# EAGLE design cooling_system_at8pu (EAGLE 8.4.0)
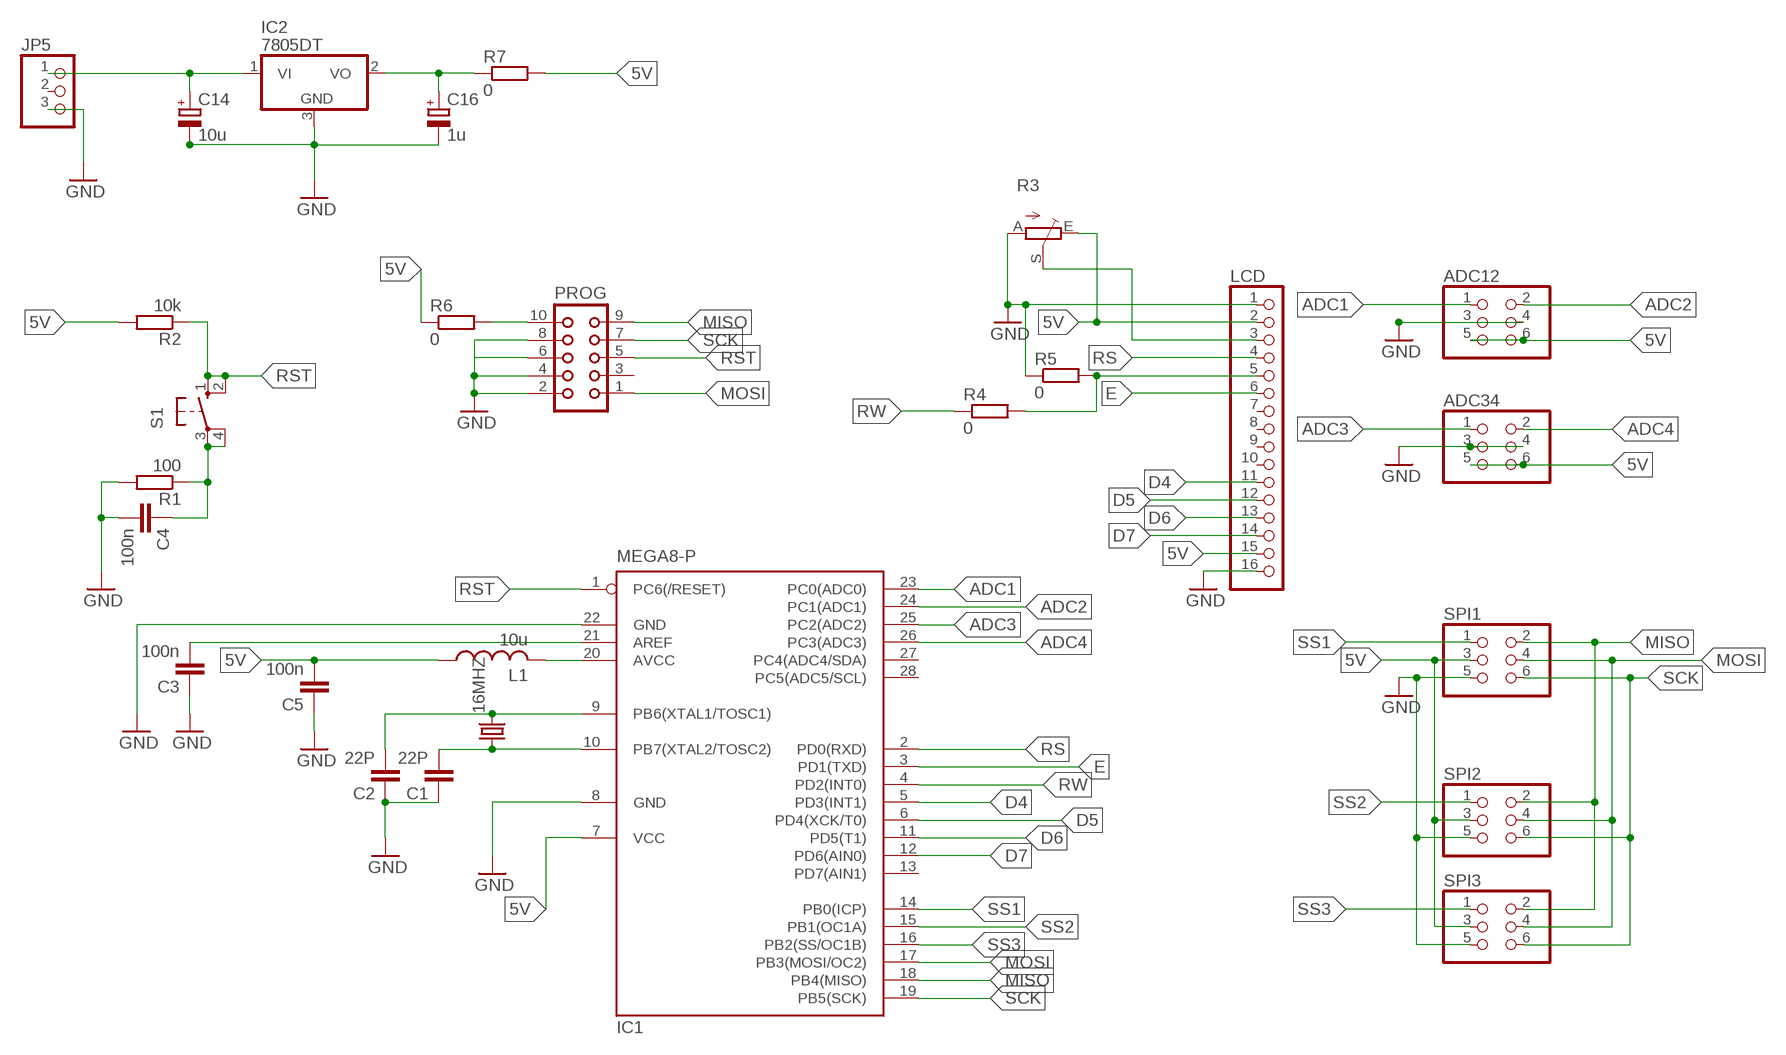
[diagram p0: schematic, sheet 1]

## Parts
16MHZ  CRYSTALHC18U-V  [HC18U-V]
ADC12  PINHD-2X3  [2X03]
ADC34  PINHD-2X3  [2X03]
C1  22P  C-EUC0805  [C0805]
C2  22P  C-EUC0805  [C0805]
C3  100n  C-EUC0805  [C0805]
C4  100n  C-EUC0805  [C0805]
C5  100n  C-EUC0805  [C0805]
C14  10u  CPOL-EU153CLV-0605  [153CLV-0605]
C16  1u  CPOL-EU153CLV-0405  [153CLV-0405]
IC1  MEGA8-P  [DIL28-3]
IC2  7805DT  [TO252]
JP5  PINHD-1X3  [1X03]
L1  10u  L-US0204/7  [0204/7]
LCD  PINHD-1X16  [1X16]
PROG  CON10  [CON10]
R1  100  R-EU_0207/10  [0207/10]
R2  10k  R-EU_0207/10  [0207/10]
R3  TRIM_EU-CT6  [CT6]
R4  0  R-EU_R0805  [R0805]
R5  0  R-EU_R0805  [R0805]
R6  0  R-EU_R0805  [R0805]
R7  0  R-EU_R0805  [R0805]
S1  10-XX  [B3F-10XX]
SPI1  PINHD-2X3  [2X03]
SPI2  PINHD-2X3  [2X03]
SPI3  PINHD-2X3  [2X03]

## Nets
5V: ADC12.5 ADC12.6 ADC34.5 ADC34.6 C5.2 IC1.7(VCC) L1.1 LCD.2 LCD.15 R2.2 R3.E R6.1 R7.2 SPI1.3 SPI2.3 SPI3.3
ADC1: ADC12.1 IC1.23(PC0(ADC0))
ADC2: ADC12.2 IC1.24(PC1(ADC1))
ADC3: ADC34.1 IC1.25(PC2(ADC2))
ADC4: ADC34.2 IC1.26(PC3(ADC3))
D4: IC1.5(PD3(INT1)) LCD.11
D5: IC1.6(PD4(XCK/T0)) LCD.12
D6: IC1.11(PD5(T1)) LCD.13
D7: IC1.12(PD6(AIN0)) LCD.14
E: IC1.3(PD1(TXD)) LCD.6
GND: ADC12.3 ADC12.4 ADC34.3 ADC34.4 C1.1 C2.1 C3.1 C4.2 C5.1 C14.- C16.- IC1.8(GND) IC1.22(GND) IC2.3(GND) JP5.3 LCD.1 LCD.16 PROG.2 PROG.4 PROG.6 PROG.8 R1.2 R3.A R5.1 SPI1.5 SPI2.5 SPI3.5
MISO: IC1.18(PB4(MISO)) PROG.9 SPI1.2 SPI2.2 SPI3.2
MOSI: IC1.17(PB3(MOSI/OC2)) PROG.1 SPI1.4 SPI2.4 SPI3.4
N$1: 16MHZ.2 C2.2 IC1.9(PB6(XTAL1/TOSC1))
N$2: 16MHZ.1 C1.2 IC1.10(PB7(XTAL2/TOSC2))
N$3: IC1.20(AVCC) L1.2
N$4: C3.2 IC1.21(AREF)
N$6: C4.1 R1.1 S1.3(P) S1.4(P1)
N$7: LCD.5 R4.2 R5.2
N$9: LCD.3 R3.S
N$12: PROG.10 R6.2
N$22: C16.+ IC2.2(VO) R7.1
N$24: C14.+ IC2.1(VI) JP5.1
RS: IC1.2(PD0(RXD)) LCD.4
RST: IC1.1(PC6(/RESET)) PROG.5 R2.1 S1.1(S) S1.2(S1)
RW: IC1.4(PD2(INT0)) R4.1
SCK: IC1.19(PB5(SCK)) PROG.7 SPI1.6 SPI2.6 SPI3.6
SS1: IC1.14(PB0(ICP)) SPI1.1
SS2: IC1.15(PB1(OC1A)) SPI2.1
SS3: IC1.16(PB2(SS/OC1B)) SPI3.1
Unconnected: IC1.13(PD7(AIN1)) IC1.27(PC4(ADC4/SDA)) IC1.28(PC5(ADC5/SCL)) JP5.2 LCD.7 LCD.8 LCD.9 LCD.10 PROG.3

## Library data of the parts
16MHZ = crystal:CRYSTAL: CRYSTAL; OC_FARNELL: unknown; OC_NEWARK: unknown
ADC12 ADC34 SPI1-SPI3 = pinhead:PINHD-2X3: PIN HEADER
C1-C5 = resistor:C-EU: CAPACITOR, European symbol
C14 C16 = resistor:CPOL-EU: POLARIZED CAPACITOR, European symbol
IC1 = atmel:MEGA8-P: MICROCONTROLLER 8 Kbytes FLASH, 1 kbytes SRAM, 512 bytes EEPROM, USART, 4-channel 10 bit ADC, 2-channel 8 bit ADC Pin compatible with Atmega48, ATMega88, ATMega168 Source: avr.lbr; OC_FARNELL: unknown; OC_NEWARK: unknown
IC2 = linear:78*: Positive VOLTAGE REGULATOR Source: http://cache.national.com/ds/LM/LM78L05.pdf http://www.fairchildsemi.com/ds/LM/LM7805.pdf
JP5 = pinhead:PINHD-1X3: PIN HEADER
L1 = resistor:L-US: INDUCTOR, American symbol
LCD = pinhead:PINHD-1X16: PIN HEADER
PROG = con-harting:CON10: CONNECTOR; OC_FARNELL: unknown; OC_NEWARK: unknown
R1 R2 R4-R7 = resistor:R-EU_: RESISTOR, European symbol
R3 = pot:TRIM_EU-: POTENTIOMETER
S1 = switch-omron:10-XX: OMRON SWITCH; MPN: B3F-1000; OC_FARNELL: 176432; OC_NEWARK: 36M3542

## Board
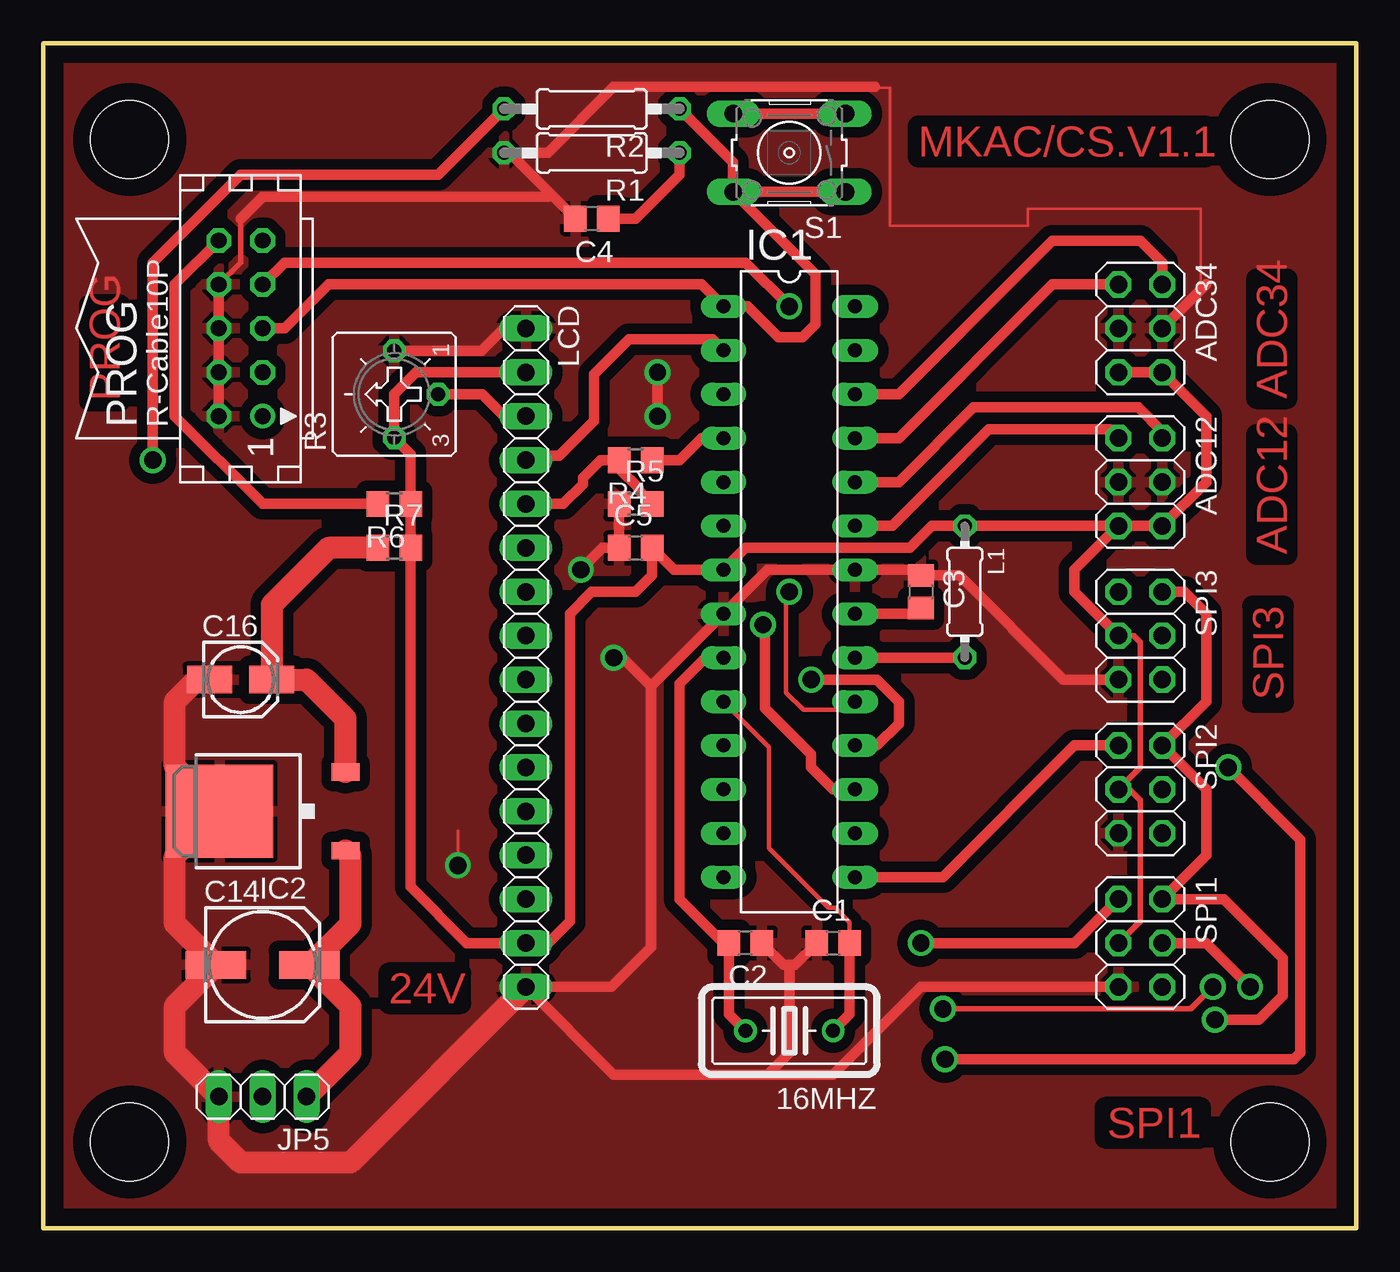
[diagram p1: board, top side]
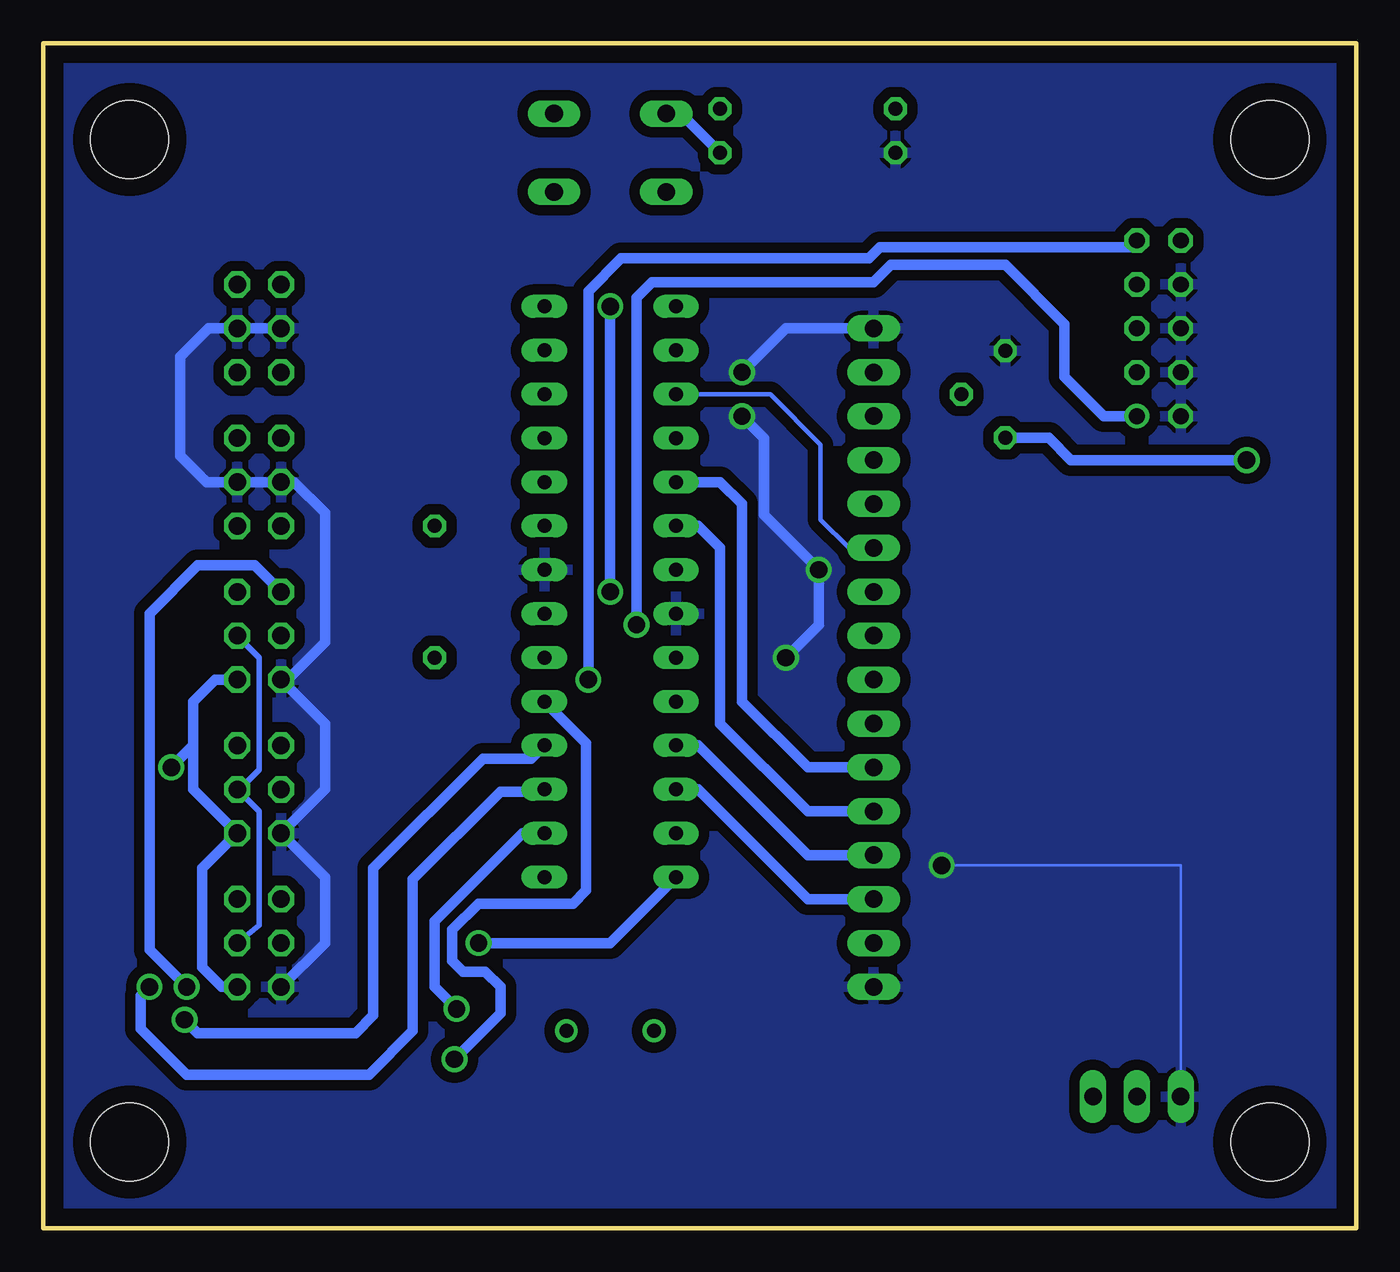
[diagram p2: board, bottom side, seen from below]

Size 76 x 68.57 mm. Coordinates in mm from the lower left corner, seen from the top.
Outline: 0,0 76,0 76,68.57 0,68.57 0,0
Copper layers (1*16): Top 0.035mm / dielectric 1.5mm / Bottom 0.035mm
Design rules "default": minimum track width 6mil, minimum drill 0.35mm, track to track 6mil, track to pad 6mil, pad to pad 6mil, via to via 6mil, smd to smd 6mil, copper to edge 40mil, drill to drill 6mil, minimum pad ring 10mil, minimum via ring 8mil, stop-mask expansion 4mil, vias tented up to drill 0mil, thermal gap 10mil
Holes 4.5 mm at 71,5 5,63 71,63 5,5

### Footprints (pad centres in the part's own frame; a part is rotated, then mirrored left to right if it is on the bottom)
HC18U-V = drill 0.813: 1 -2.54,0; 2 2.54,0
2X03 = drill 1.016 octagon: 1 -2.54,-1.27; 2 -2.54,1.27; 3 0,-1.27; 4 0,1.27; 5 2.54,-1.27; 6 2.54,1.27
C0805 = smd 1.3 x 1.5: 1 -0.95,0; 2 0.95,0
153CLV-0605 = smd 3.5 x 1.6: + 2.7,0; - -2.7,0
153CLV-0405 = smd 2.6 x 1.6: + 1.8,0; - -1.8,0
DIL28-3 = drill 0.813 long: 1 -16.51,-3.81; 2 -13.97,-3.81; 3 -11.43,-3.81; 4 -8.89,-3.81; 5 -6.35,-3.81; 6 -3.81,-3.81; 7 -1.27,-3.81; 8 1.27,-3.81; 9 3.81,-3.81; 10 6.35,-3.81; 11 8.89,-3.81; 12 11.43,-3.81; 13 13.97,-3.81; 14 16.51,-3.81; 15 16.51,3.81; 16 13.97,3.81; 17 11.43,3.81; 18 8.89,3.81; 19 6.35,3.81; 20 3.81,3.81; 21 1.27,3.81; 22 -1.27,3.81; 23 -3.81,3.81; 24 -6.35,3.81; 25 -8.89,3.81; 26 -11.43,3.81; 27 -13.97,3.81; 28 -16.51,3.81
TO252 = smd 1 x 1.6: 1 -2.28,-4.8; 2 2.28,-4.8 | smd 5.4 x 6.2: 3 0,2.5
1X03 = drill 1.016 long: 1 -2.54,0; 2 0,0; 3 2.54,0
0204/7 = drill 0.813 octagon: 1 -3.81,0; 2 3.81,0
1X16 = drill 1.016 long: 1 -19.05,0; 2 -16.51,0; 3 -13.97,0; 4 -11.43,0; 5 -8.89,0; 6 -6.35,0; 7 -3.81,0; 8 -1.27,0; 9 1.27,0; 10 3.81,0; 11 6.35,0; 12 8.89,0; 13 11.43,0; 14 13.97,0; 15 16.51,0; 16 19.05,0
CON10 = drill 0.914: 1 -5.08,-1.27 | drill 0.914 octagon: 2 -5.08,1.27; 3 -2.54,-1.27; 4 -2.54,1.27; 5 0,-1.27; 6 0,1.27; 7 2.54,-1.27; 8 2.54,1.27; 9 5.08,-1.27; 10 5.08,1.27
0207/10 = drill 0.813 octagon: 1 -5.08,0; 2 5.08,0
CT6 = drill 0.813 octagon: A 2.515,0; E -2.515,0; S 0,-2.54
R0805 = smd 1.3 x 1.5: 1 -0.95,0; 2 0.95,0
B3F-10XX = drill 1.016 long: 1 -3.251,2.261; 2 3.251,2.261; 3 -3.251,-2.261; 4 3.251,-2.261

### Placement (x,y rotation side)
16MHZ  43.18,11.43 180 top
ADC12  63.5,43.18 270 top
ADC34  63.5,52.07 270 top
C1  45.72,16.51 0 top
C2  40.64,16.51 180 top
C3  50.8,36.83 270 top
C4  31.75,58.42 180 top
C5  34.29,39.37 0 top
C14  12.7,15.24 0 top
C16  11.43,31.75 0 top
IC1  43.18,36.83 270 top
IC2  12.7,24.13 90 top
JP5  12.7,7.62 180 top
L1  53.34,36.83 270 top
LCD  27.94,33.02 270 top
PROG  11.43,52.07 90 top
R1  31.75,62.23 180 top
R2  31.75,64.77 180 top
R3  20.32,48.26 90 top
R4  34.29,44.45 180 top
R5  34.29,41.91 0 top
R6  20.32,41.91 180 top
R7  20.32,39.37 0 top
S1  43.18,62.23 180 top
SPI1  63.5,16.51 270 top
SPI2  63.5,25.4 270 top
SPI3  63.5,34.29 270 top

### Tracks (layer width: path | path; a pad name or v marks a point on that pad's centre or on a via)
5V  (via drill 1)
  Top 0.305: SPI1.3 63.5,17.78 63.5,24.77 62.87,25.4 SPI2.3 63.5,26.67 63.5,33.91 63.12,34.29 SPI3.3
  Top 0.61: ADC12.5 L1.1 51.44,40.64 50.16,39.37 40.64,39.37 IC1.7 36.51,38.1 C5.2 35.24,37.78 34.29,36.83 31.75,36.83 30.48,35.56 30.48,17.78 29.21,16.51 LCD.15 24.51,16.51 21.27,19.75 R7.2 R6.1 21.27,44.8 R3.E 20.32,48.26 21.59,49.53 LCD.2 | ADC12.5 ADC12.6 67.31,43.18 67.31,46.99 ADC34.6 ADC34.5 | ADC12.5 59.69,38.1 59.69,36.83 SPI3.3 | R2.2 22.86,60.96 11.43,60.96 6.35,55.88 v6.35,44.45
  Bottom 0.61: v6.35,44.45 16.51,44.45 17.8,45.74 R3.E
ADC1
  Top 0.61: ADC12.1 61.72,46.23 54.74,46.23 49.15,40.64 IC1.23
ADC2
  Top 0.61: IC1.24 49.53,43.18 53.85,47.5 63.37,47.5 64.77,46.1 ADC12.2
ADC3
  Top 0.61: ADC34.1 58.42,54.61 49.53,45.72 IC1.25
ADC4
  Top 0.61: IC1.26 49.53,48.26 58.42,57.15 63.5,57.15 64.77,55.88 ADC34.2
D4
  Bottom 0.61: IC1.5 36.83,43.18 35.56,41.91 35.56,30.48 31.75,26.67 LCD.11
D5
  Bottom 0.61: LCD.12 31.75,24.13 36.83,29.21 36.83,39.37 38.1,40.64 IC1.6
D6
  Bottom 0.61: IC1.11 38.1,27.94 31.75,21.59 LCD.13
D7
  Bottom 0.61: IC1.12 38.1,25.4 31.75,19.05 LCD.14
E
  Bottom 0.254: IC1.3 33.91,48.26 31,45.35 31,41 29.37,39.37 LCD.6
GND  (via drill 1)
  Top 0.152: v24,21 24,23 | 48.15,66.04 48.15,66 49,66 49,58 57,58 57,59 67,59 67,54.15 66.85,54.15
  Top 0.305: PROG.8 11.43,55.88 11.43,58.42
  Top 0.61: SPI3.5 59.05,31.75 53.02,37.78 C3.1 50.48,38.1 IC1.22 41.91,38.1 IC1.8 35.18,31.37 | 41.91,8.89 33.02,8.89 LCD.16 32.89,13.97 35.18,16.26 35.18,31.37 | 41.91,8.89 43.18,10.16 43.18,15.24 | C2.1 42.86,15.24 43.18,15.24 | 43.18,15.24 43.5,15.24 C1.1 | SPI1.5 50.8,13.97 45.72,8.89 41.91,8.89 | R3.A 25.38,50.77 26.67,52.07 LCD.1 | 29.37,59.85 C4.2 | 29.37,59.85 26.99,62.23 R1.2 29.21,62.23 33.02,66.04 48.15,66.04 | PROG.2 PROG.4 PROG.6 PROG.8 | 11.43,58.42 12.7,59.69 29.21,59.69 29.37,59.85 | 67.31,54.61 66.85,54.15 ADC34.4 | v31.11,38.1 32.38,39.37 C5.1 R5.1 | v33.02,33.02 33.53,33.02 35.18,31.37 | v35.56,46.99 v35.56,49.53
  Top 1.27: C16.- 8.89,31.75 7.62,30.48 7.62,26.71 IC2.3 7.62,21.55 7.62,17.62 C14.- 7.62,12.86 7.62,10.16 JP5.3 10.16,5.08 11.43,3.81 17.78,3.81 LCD.16
  Bottom 0.152: JP5.3 10.16,21 v24,21
  Bottom 0.61: SPI1.5 59.69,16.51 59.69,20.32 SPI2.5 59.69,25.4 59.69,29.21 SPI3.5 61.85,31.75 59.69,33.91 59.69,41.4 61.47,43.18 ADC12.3 ADC12.4 66.55,43.18 68.07,44.7 68.07,50.42 66.42,52.07 ADC34.4 ADC34.3 | v33.02,33.02 31.11,34.92 v31.11,38.1 34.29,41.27 34.29,45.72 v35.56,46.99 | v35.56,49.53 33.02,52.07 LCD.1
  pour Top (isolate 0.61): 1.27,1.27 1.27,68.58 74.93,68.58 74.93,1.27
  pour Bottom (isolate 0.61): 1.27,1.27 1.27,68.58 74.93,68.58 74.93,1.27
MISO  (via drill 1)
  Top 0.61: SPI3.2 66.04,36.83 67.31,35.56 67.31,30.48 SPI2.2 67.31,25.4 67.31,21.59 SPI1.2 68.33,19.05 71.75,15.62 71.75,13.46 70.36,12.06 v67.82,12.06 | v44.45,31.75 48.26,31.75 49.53,30.48 49.53,29.21 48.26,27.94 IC1.18
  Bottom 0.61: IC1.18 47.75,27.18 50.55,27.18 56.9,20.83 56.9,12.32 57.91,11.3 67.06,11.3 v67.82,12.06 | PROG.9 13.08,56.77 27.56,56.77 28.19,56.13 42.55,56.13 44.45,54.23 v44.45,31.75
MOSI  (via drill 1)
  Top 0.61: v69.85,13.97 67.31,16.51 SPI1.4 | IC1.17 45.72,25.4 44.45,26.67 44.45,27.43 41.78,30.1 41.78,34.8 v41.66,34.92
  Bottom 0.305: SPI3.4 63.5,33.02 63.5,26.54 64.64,25.4 SPI2.4 63.5,24.13 63.5,17.53 SPI1.4
  Bottom 0.61: IC1.17 47.12,25.27 49.53,25.27 54.61,20.19 54.61,11.43 57.15,8.89 67.69,8.89 70.36,11.56 70.36,13.46 v69.85,13.97 | v41.66,34.92 41.66,53.85 40.77,54.74 27.94,54.74 26.92,55.75 20.32,55.75 16.89,52.32 16.89,49.28 14.61,46.99 PROG.1
N$1
  Top 0.254: IC1.9 39.98,33.02 40,33
  Top 0.61: 16MHZ.2 39.69,12.38 C2.2 39.37,16.51 36.83,19.05 36.83,31.5 38.48,33.15 38.61,33.02 IC1.9
N$2
  Top 0.254: IC1.10 42,27.85 42,22 45.46,18.54 45.85,18.54 46.67,17.72 C1.2
  Top 0.61: C1.2 46.67,12.38 16MHZ.1
N$3
  Top 0.61: L1.2 IC1.20
N$4
  Top 0.61: IC1.21 50.48,35.56 C3.2
N$6
  Top 0.61: C4.1 34.29,58.42 36.83,60.96 R1.1 | S1.3 S1.4
  Bottom 0.61: R1.1 39.09,64.49 S1.4
N$7
  Top 0.61: LCD.5 30.1,41.91 31.24,43.05 31.24,43.43 32.26,44.45 R4.2 33.34,43.96 34.45,42.85 34.45,42.7 R5.2
N$9
  Top 0.61: LCD.3 26.67,46.99 25.4,48.26 R3.S
N$12
  Top 0.61: PROG.10 7.62,54.61 7.62,46.99 12.7,41.91 R6.2
N$22
  Top 1.27: IC2.2 17.5,29.49 15.24,31.75 C16.+ 13.23,36.09 16.51,39.37 R7.1
N$24
  Top 1.27: JP5.1 17.78,10.16 17.78,12.86 C14.+ 17.78,17.62 17.78,21.57 IC2.1
RS
  Top 0.61: LCD.4 28.19,44.7 29.84,44.7 31.88,46.74 31.88,49.4 33.91,51.44 38.73,51.44 IC1.2
RST
  Top 0.61: PROG.5 13.97,52.07 16.51,54.61 38.1,54.61 IC1.1 40.77,53.34 42.55,51.56 43.94,51.56 44.7,52.32 44.7,55.19 S1.2 | S1.2 39.93,61.67 R2.1 | S1.1 S1.2
RW
  Top 0.61: IC1.4 38.1,45.72 36.83,44.45 R4.1
SCK  (via drill 1)
  Top 0.254: v43.18,36.83 43,36.65 43,31 44,30 46,30 46.48,30.48 IC1.19
  Top 0.61: v68.58,26.67 72.77,22.48 72.77,10.16 72.39,9.78 v52.2,9.78 | IC1.19 46.93,30.54 | v43.18,53.34 40.64,55.88 13.97,55.88 PROG.7
  Bottom 0.61: SPI1.6 65.66,13.97 66.8,15.11 66.8,20.83 SPI2.6 67.31,25.4 67.31,27.94 | 67.31,27.94 67.31,30.48 66.04,31.75 SPI3.6 | 67.31,27.94 v68.58,26.67 | v52.2,9.78 49.53,12.45 49.53,13.97 50.42,14.86 51.69,14.86 52.32,15.49 52.32,17.27 50.8,18.8 45.34,18.8 44.58,19.56 44.58,28.07 IC1.19 | v43.18,36.83 v43.18,53.34
SS1  (via drill 1)
  Top 0.61: v50.8,16.51 59.69,16.51 SPI1.1
  Bottom 0.61: IC1.14 43.18,16.51 v50.8,16.51
SS2
  Top 0.61: IC1.15 52.07,20.32 59.69,27.94 SPI2.1
SS3  (via drill 1)
  Top 0.305: v52.07,12.7 66.42,12.7 v67.69,13.97
  Bottom 0.61: SPI3.1 63.75,38.35 67.06,38.35 69.85,35.56 69.85,16.13 v67.69,13.97 | v52.07,12.7 53.34,13.97 53.34,17.78 48.26,22.86 IC1.16

### Text on the board
Top: MKAC/CS.V1.1 | PROG | ADC34 | ADC12 | SPI3 | 24V | SPI1